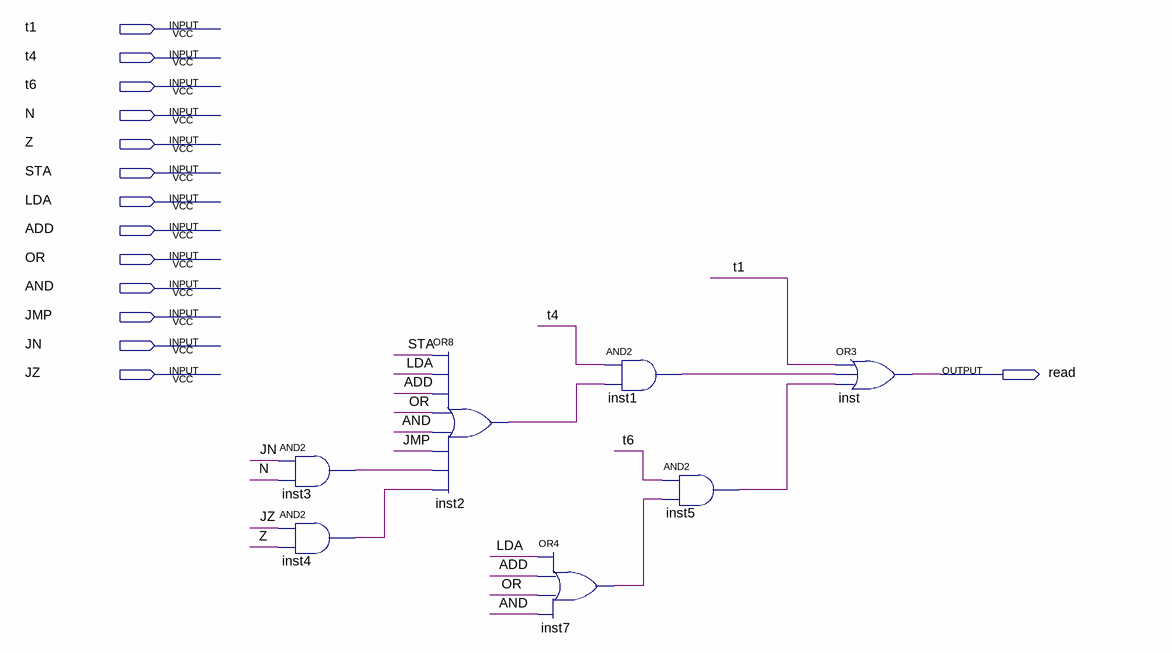
[diagram p0: schematic sheet]
// Quartus schematic read.bdf as structural Verilog: 7 symbols, 14 pins
module read (
  input  t1,
  input  t4,
  input  t6,
  input  N,
  input  Z,
  input  STA,
  input  LDA,
  input  ADD,
  input  OR,
  input  AND,
  input  JMP,
  input  JN,
  input  JZ,
  output read
);

  wire inst1_out, inst2_out, inst3_out, inst4_out, inst5_out, inst7_out;

  and inst3 (inst3_out, JN, N);
  and inst4 (inst4_out, JZ, Z);
  or inst2 (inst2_out, STA, LDA, ADD, OR, AND, JMP, inst3_out, inst4_out);
  or inst7 (inst7_out, LDA, ADD, OR, AND);
  and inst1 (inst1_out, t4, inst2_out);
  and inst5 (inst5_out, t6, inst7_out);
  or inst (read, t1, inst1_out, inst5_out);
endmodule
